# Altium project PCB_Project_1.PrjPcb
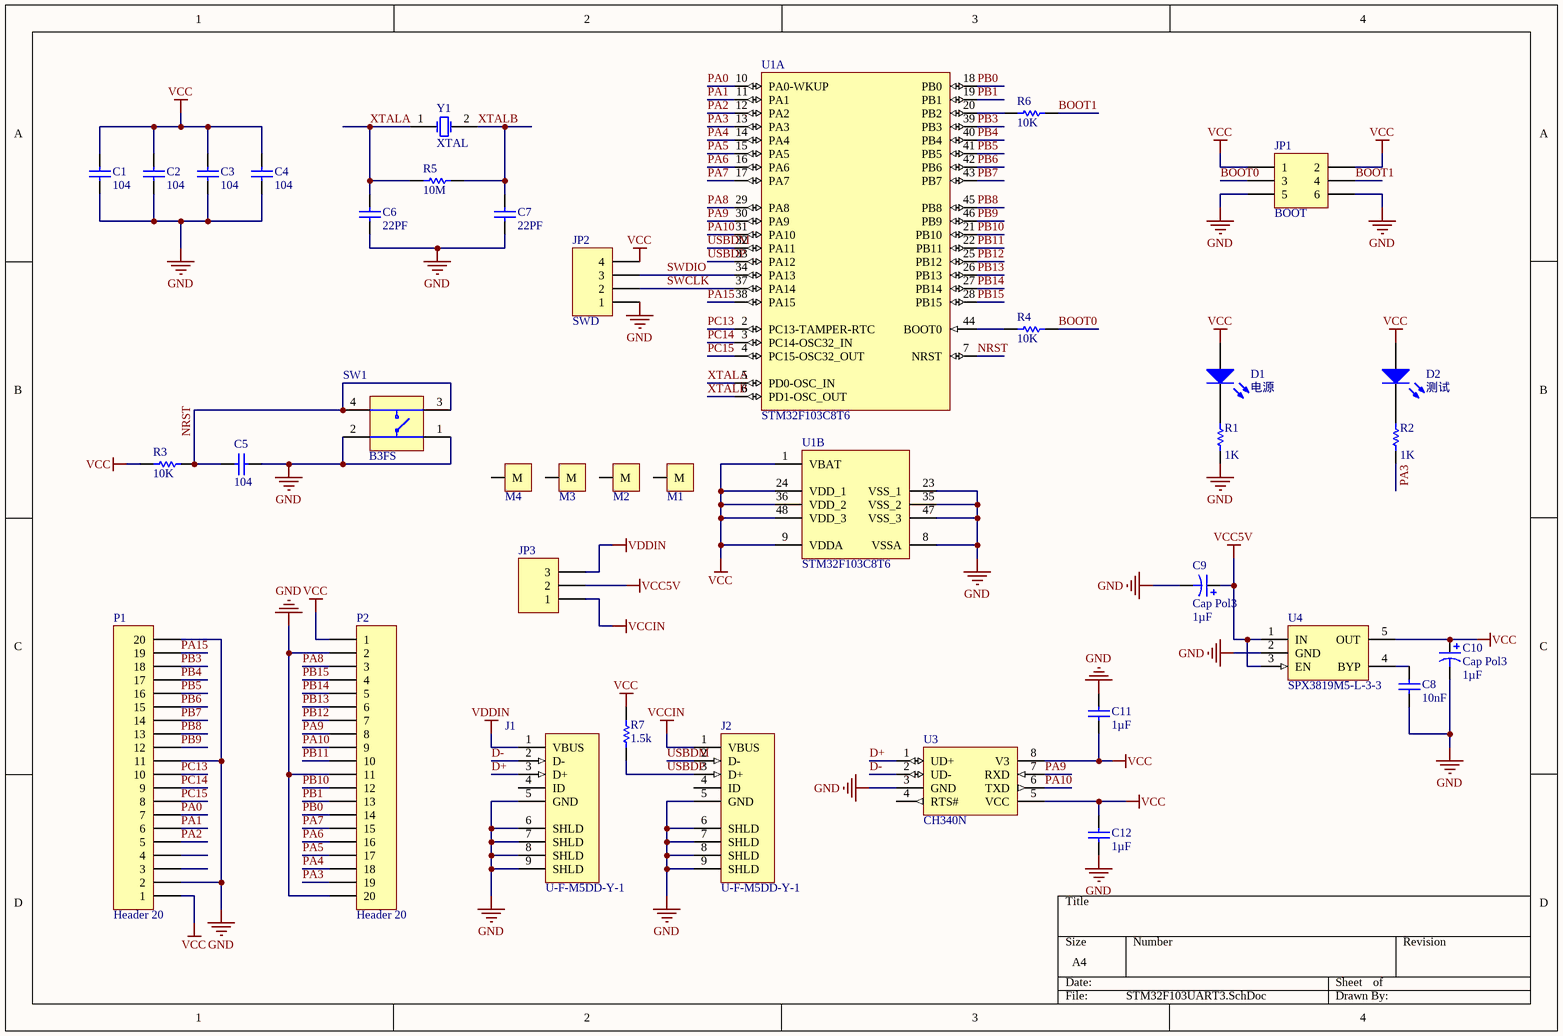
[diagram p0: STM32F103UART3.SchDoc]
1 sheet, 37 parts. Net scope: global (net labels, ports and power ports of the same name join across sheets).
Board file: STM32F103UART3.PcbDoc

## Sheet STM32F103UART3.SchDoc
size A4

### Parts
C1  value 104  [C0603]  (hidden comment: Cap Semi)
C2  value 104  [C0603]  (hidden comment: Cap Semi)
C3  value 104  [C0603]  (hidden comment: Cap Semi)
C4  value 104  [C0603]  (hidden comment: Cap Semi)
C5  value 104  [C0603]  (hidden comment: Cap Semi)
C6  value 22PF  [C0603]  (hidden comment: Cap Semi)
C7  value 22PF  [C0603]  (hidden comment: Cap Semi)
C8  value 10nF  [C0603]  (hidden comment: Cap Semi)
C9  Cap Pol3  value 1µF  [C_CASE_A]
C10  Cap Pol3  value 1µF  [C_CASE_A]
C11  value 1µF  [C0603]  (hidden comment: Cap Semi)
C12  value 1µF  [C0603]  (hidden comment: Cap Semi)
D1  电源  [LED0603]
D2  测试  [LED0603]
J1  U-F-M5DD-Y-1  [USB_MICRO_B_U-F-M5DD-Y-1]
J2  U-F-M5DD-Y-1  [USB_MICRO_B_U-F-M5DD-Y-1]
JP1  BOOT  [HDR2X3]
JP2  SWD  [HDR1X4]
JP3  Header 3  [HDR1X3]  (value not drawn)
M1  MOUNT  [MOUNT3]  (value not drawn)
M2  MOUNT  [MOUNT3]  (value not drawn)
M3  MOUNT  [MOUNT3]  (value not drawn)
M4  MOUNT  [MOUNT3]  (value not drawn)
P1  Header 20  [HDR1X20]
P2  Header 20  [HDR1X20]
R1  value 1K  [R0603]  (hidden comment: Res Semi)
R2  value 1K  [R0603]  (hidden comment: Res Semi)
R3  value 10K  [R0603]  (hidden comment: Res Semi)
R4  value 10K  [R0603]  (hidden comment: Res2)
R5  value 10M  [R0603]  (hidden comment: Res3)
R6  value 10K  [R0603]  (hidden comment: Res2)
R7  value 1.5k  [R0603]  (hidden comment: Res3)
SW1  B3FS  [SW_B3FS]
U1  STM32F103C8T6  [STM-LQFP48_N]  (parts A,B of 2)
U3  CH340N  [SOP8_N]
U4  SPX3819M5-L-3-3  [SOT-23-5]
Y1  XTAL  [OSC5032_2P_AD]

### Nets
GND: C1.2 C2.2 C3.2 C4.2 C5.2 C6.2 C7.2 C8.2 C9.2 C10.2 C11.2 C12.1 J1.5(GND) J1.6(SHLD) J1.7(SHLD) J1.8(SHLD) J1.9(SHLD) J2.5(GND) J2.6(SHLD) J2.7(SHLD) J2.8(SHLD) J2.9(SHLD) JP1.5 JP1.6 JP2.1 P1.2 P1.11 P1.20 P2.2 P2.11 P2.20 R1.1 SW1.1 SW1.2 U1.8(VSSA) U1.23(VSS_1) U1.35(VSS_2) U1.47(VSS_3) U3.3(GND) U4.2(GND)
VCC: C1.1 C2.1 C3.1 C4.1 C10.1 C11.1 C12.2 D1.1(A) D2.1(A) JP1.1 JP1.2 JP2.4 P1.1 P2.1 R3.2 R7.1 U1.1(VBAT) U1.9(VDDA) U1.24(VDD_1) U1.36(VDD_2) U1.48(VDD_3) U3.5(VCC) U3.8(V3) U4.5(OUT)
VCC5V: C9.1 JP3.2 U4.1(IN) U4.3(EN)
VCCIN: J2.1(VBUS) JP3.1
VDDIN: J1.1(VBUS) JP3.3
BOOT0: JP1.3 R4.1
BOOT1: JP1.4 R6.1
D+: J1.3(D+) U3.1(UD+)
D-: J1.2(D-) U3.2(UD-)
NRST: C5.1 R3.1 SW1.3 SW1.4 U1.7(NRST)
PA0: P1.7 U1.10(PA0-WKUP)
PA1: P1.6 U1.11(PA1)
PA2: P1.5 U1.12(PA2)
PA3: P2.19 R2.1 U1.13(PA3)
PA4: P2.18 U1.14(PA4)
PA5: P2.17 U1.15(PA5)
PA6: P2.16 U1.16(PA6)
PA7: P2.15 U1.17(PA7)
PA8: P2.3 U1.29(PA8)
PA9: P2.8 U1.30(PA9) U3.7(RXD)
PA10: P2.9 U1.31(PA10) U3.6(TXD)
PA15: P1.19 U1.38(PA15)
PB0: P2.14 U1.18(PB0)
PB1: P2.13 U1.19(PB1)
PB3: P1.18 U1.39(PB3)
PB4: P1.17 U1.40(PB4)
PB5: P1.16 U1.41(PB5)
PB6: P1.15 U1.42(PB6)
PB7: P1.14 U1.43(PB7)
PB8: P1.13 U1.45(PB8)
PB9: P1.12 U1.46(PB9)
PB10: P2.12 U1.21(PB10)
PB11: P2.10 U1.22(PB11)
PB12: P2.7 U1.25(PB12)
PB13: P2.6 U1.26(PB13)
PB14: P2.5 U1.27(PB14)
PB15: P2.4 U1.28(PB15)
PC13: P1.10 U1.2(PC13-TAMPER-RTC)
PC14: P1.9 U1.3(PC14-OSC32_IN)
PC15: P1.8 U1.4(PC15-OSC32_OUT)
SWCLK: JP2.2 U1.37(PA14)
SWDIO: JP2.3 U1.34(PA13)
USBDM: J2.2(D-) U1.32(PA11)
USBDP: J2.3(D+) R7.2 U1.33(PA12)
XTALA: C6.1 R5.2 U1.5(PD0-OSC_IN) Y1.1(OSC1)
XTALB: C7.1 R5.1 U1.6(PD1-OSC_OUT) Y1.2(OSC2)
NetC8_1: C8.1 U4.4(BYP)
NetD1_2: D1.2(K) R1.2
NetD2_2: D2.2(K) R2.2
NetR4_2: R4.2 U1.44(BOOT0)
NetR6_2: R6.2 U1.20(PB2)

Not connected (* = marked no-connect by the designer): J1 4(ID); J2 4(ID); M1 1(M); M2 1(M); M3 1(M); M4 1(M); P1 3 4; U3 4(RTS#)

### Library data of the parts
C1-C8 C11 C12 = Cap Semi: Capacitor (Semiconductor SIM Model); Published: 8-Jun-2000; LatestRevisionDate: 29-May-2009; LatestRevisionNote: IPC-7351 Footprint Added.; PackageReference: C1206; Publisher: Altium Limited; PackageDescription: Chip Capacitor
C9 C10 = Cap Pol3: Polarized Capacitor (Surface Mount); Published: 8-Jun-2000; LatestRevisionDate: 29-May-2009; LatestRevisionNote: IPC-7351 Footprint Added.; PackageReference: C0805; Publisher: Altium Limited; PackageDescription: Chip Capacitor
D1 D2 = LED2: Typical RED, GREEN, YELLOW, AMBER GaAs LED; Published: 8-Jun-2000; LatestRevisionDate: 17-Jul-2002; LatestRevisionNote: Re-released for DXP Platform.; PackageVersion: Feb-2002; PackageReference: 3.2X1.6X1.1; Publisher: Altium Limited; PackageDescription: SM LED; 2 Flat Leads
J1 J2 = USB_MICRO: 5-PIN USB SERIES MICRO-B REC; Manufacturer: HRO; ContactMaterial: Phosphor Bronze; ContactPlating: Gold over Nickel; TerminationLength: 3.00mm [0.118in.]; PCB_Layout: Complies with manufacturer's recommendation.; DrillSize: Corresponds to nominal value.; PanelGround: Without; Published: 15-Jul-2004; DatasheetDocument: 02-Jun-2001; PackageDocument: 02-Jun-2001; PackageReference: 1-1470156; Publisher: Altium Limited; HousingMaterial: Glass-Filled Thermoplastic; ComponentLink1Description: Manufacturer Link; ComponentLink1URL: http://www.tycoelectronics.com/; ComponentLink2Description: Packaging Specification; ComponentLink2URL: http://ecommas.tycoelectronics.com/commerce/DocumentDelivery/DDEController?Action=showdoc&DocId=Customer+Drawing%7F1470156%7FO%7Ftif%7FEnglish%7FC_1470156_O.tif
JP1 = Header 3X2: Header, 3-Pin, Dual row; LatestRevisionDate: 17-Jul-2002; LatestRevisionNote: Re-released for DXP Platform.; Publisher: Altium Limited
JP2 = Header 4: Header, 4-Pin; LatestRevisionDate: 17-Jul-2002; LatestRevisionNote: Re-released for DXP Platform.; Publisher: Altium Limited
JP3 = Header 3: Header, 3-Pin; LatestRevisionDate: 17-Jul-2002; LatestRevisionNote: Re-released for DXP Platform.; Publisher: Altium Limited
M1-M4 = MOUNT: Mount, Hole Size 3mm, Diameter 5.3; LatestRevisionDate: 17-Jul-2002; LatestRevisionNote: Re-released for DXP Platform.; Publisher: Altium Limited
P1 P2 = Header 20: Header, 20-Pin; LatestRevisionDate: 17-Jul-2002; LatestRevisionNote: Re-released for DXP Platform.; Publisher: Altium Limited
R1-R7 = Res Semi: Semiconductor Resistor; Published: 8-Jun-2000; LatestRevisionDate: 17-Jul-2002; LatestRevisionNote: Re-released for DXP Platform.; PackageReference: AXIAL-0.5; Publisher: Altium Limited; PackageDescription: Axial Device, Thru-Hole; 2 Leads; 0.5 in Pin Spacing
SW1 = B3FS: 6x6 mm, SPNA SMD Keyboard Switch (TACT Switch); Published: 5-Jan-2004; Publisher: Altium Limited
U1 = STM32F103C8T6: ARM Cortex-M3 32-bit MCU, 64 KB Flash, 20 KB Internal RAM, 37 I/Os, 48-pin LQFP, -40 to 85 degC, Tray; A/D Converter: 2x12-bit (10 Channel); FLASH Size (Prog) (kB): 64; I/Os (High Current): 37; Internal RAM Size (kB): 20; Operating Frequency(F) (Processor speed) (MHz): 72; Supply Voltage(Vcc) min (V): 2; DatasheetVersion: Rev. 16; PackageVersion: Rev. 6, 06/2013; PackageReference: LQFP48; PackageDescription: 48-Pin Low Profile Quad Flat Package, 7 x 7 mm Body, 0.5 mm Pitch; Supplier 1: Digi-Key; Supplier Part Number 1: 497-6063-ND; Supplier 2: Farnell; Supplier Part Number 2: 1447637; Supplier 3: Newark; Supplier Part Number 3: 59M2182; Supplier 4: Newark; Supplier Part Number 4: 57P1222; Supplier 5: Mouser; Supplier Part Number 5: 511-STM32F103C8T6; Core: ARM Cortex-M3; Packing: Tray; Mounting Technology: Surface Mount; PartNumber: STM32F103C8T6; ComponentLink1Description: Manufacturer URL; ComponentLink1URL: http://www.st.com/web/en/home.html; ComponentLink2Description: Datasheet; ComponentLink2URL: http://www.st.com/st-web-ui/static/active/en/resource/technical/document/datasheet/CD00161566.pdf; ComponentLink3Description: Package Specification; ComponentLink3URL: http://www.st.com/st-web-ui/static/active/en/resource/technical/document/datasheet/DM00058181.pdf
U3 = CH340N: USB to Serial Chip; Manufacturer: WCH; LatestRevisionDate: 17-Jul-2002; LatestRevisionNote: Re-released for DXP Platform.; Publisher: Altium Limited
U4 = SPX3819M5: 500mA, 16V Low-Noise LDO Voltage Regulator; Manufacturer: Exar; Marking: L3WW; Published: 5-Jan-2004; Publisher: Altium Limited
Y1 = XTAL: Crystal Oscillator; Published: 8-Jun-2000; LatestRevisionDate: 17-Jul-2002; LatestRevisionNote: Re-released for DXP Platform.; PackageReference: R38; Publisher: Altium Limited; PackageDescription: Crystal, Thru-Hole; 2 Leads; Body 3.1 x 8.2 mm (Dia.xH)